# EAGLE schematic Aegis_PCB_MB_v46 (EAGLE 9.7.0)

## Sheet 1 of 12: Battery Charger
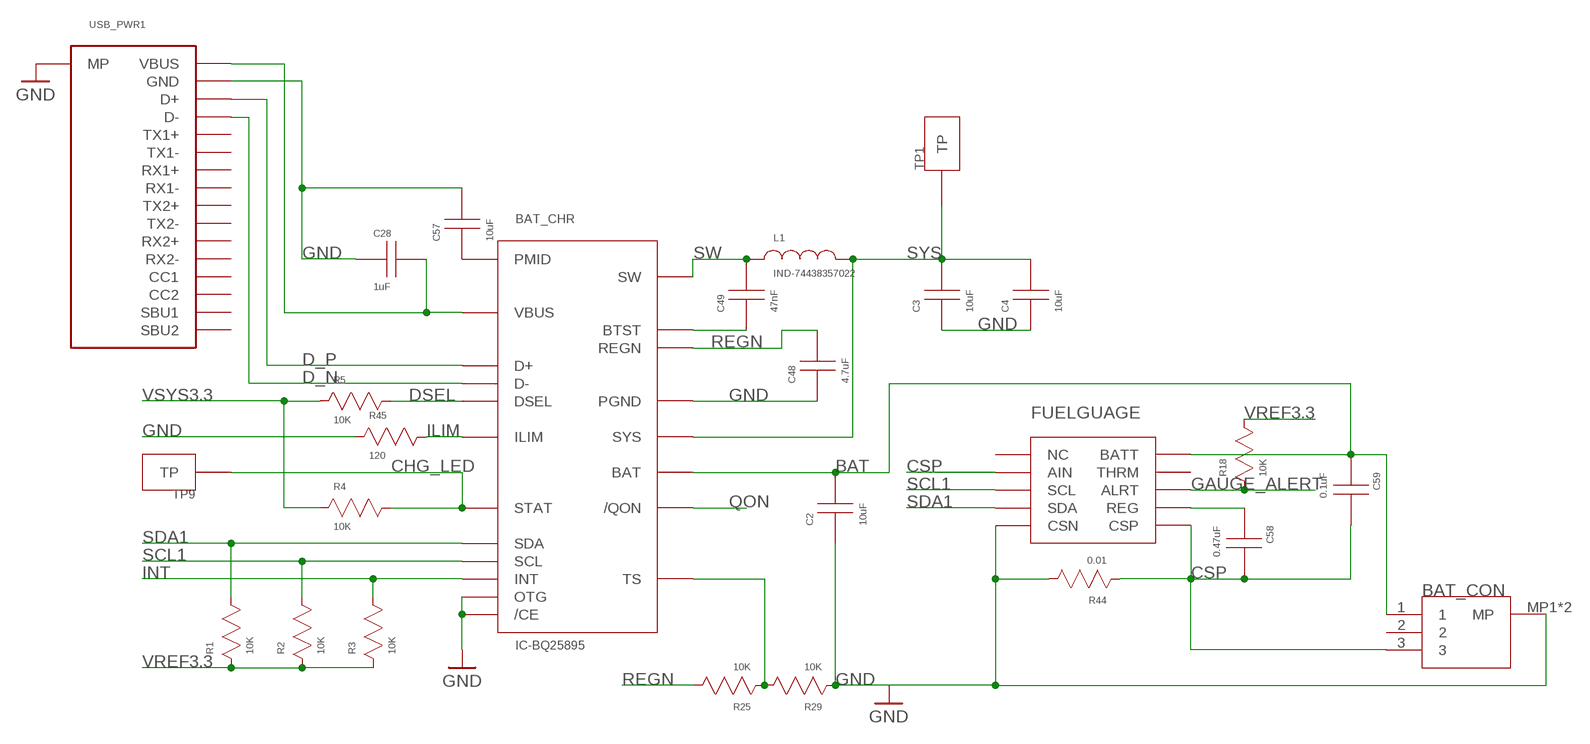
[diagram p0: schematic, sheet 1]

### Parts
BAT_CHR  IC-BQ25895  [IC-BQ25895]
BAT_CON  CONN-AUH03  [CONN_AUH03]
C2  10uF  CAP-603  [CAP-603]
C3  10uF  CAP-603  [CAP-603]
C4  10uF  CAP-603  [CAP-603]
C28  1uF  CAP-603  [CAP-603]
C48  4.7uF  CAP-603  [CAP-603]
C49  47nF  CAP-603  [CAP-603]
C57  10uF  CAP-603  [CAP-603]
C58  0.47uF  CAP-603  [CAP-603]
C59  0.1uF  CAP-603  [CAP-603]
FUELGUAGE  IC-MAX17055  [IC-MAX17055]
L1  IND-74438357022  [IND-74438357022]
R1  10K  RES-603  [RES-603]
R2  10K  RES-603  [RES-603]
R3  10K  RES-603  [RES-603]
R4  10K  RES-603  [RES-603]
R5  10K  RES-603  [RES-603]
R18  10K  RES-603  [RES-603]
R25  10K  RES-603  [RES-603]
R29  10K  RES-603  [RES-603]
R44  0.01  RES-603  [RES-603]
R45  120  RES-603  [RES-603]
TP1  TESTPOINT  [TESTPOINT]
TP9  TESTPOINT  [TESTPOINT]
USB_PWR1  USBC-USB-C31-S-RA-CS1D-BK-T/R  [USBC-USB-C31-S-RA-CS1D-BK-T/R]

### Nets
BAT: BAT_CHR.BAT1(BAT) BAT_CHR.BAT2(BAT) BAT_CON.1 C2.C C59.A FUELGUAGE.BATT
CHG_LED: BAT_CHR.STAT R4.C TP9.TP ; also sheet 10
CSP: BAT_CON.3 C58.C C59.C FUELGUAGE.AIN FUELGUAGE.CSP FUELGUAGE.EP(CSP) R44.A
D_N: BAT_CHR.D- USB_PWR1.D- USB_PWR1.D-_2(D-)
D_P: BAT_CHR.D+ USB_PWR1.D+ USB_PWR1.D+_2(D+)
DSEL: BAT_CHR.DSEL R5.C
GAUGE_ALERT: FUELGUAGE.ALRT R18.A
GND: BAT_CHR./CE BAT_CHR.OTG BAT_CHR.PGND1(PGND) BAT_CHR.PGND2(PGND) BAT_CHR.PWRPAD(PGND) BAT_CON.MP1(MP) BAT_CON.MP2(MP) C2.A C3.A C4.A C28.A C48.A C57.C FUELGUAGE.CSN R29.A R44.C R45.A USB_PWR1.GND_1(GND) USB_PWR1.GND_2(GND) USB_PWR1.GND_3(GND) USB_PWR1.GND_4(GND) USB_PWR1.MP_1(MP) USB_PWR1.MP_2(MP) USB_PWR1.MP_3(MP) USB_PWR1.MP_4(MP) ; also sheet 2,3,4,5,6,7,8,9,10,11,12
ILIM: BAT_CHR.ILIM R45.C
INT: BAT_CHR.INT R3.C
N$1: BAT_CHR.BTST C49.A
N$2: BAT_CHR.VBUS C28.C USB_PWR1.VBUS_1(VBUS) USB_PWR1.VBUS_2(VBUS) USB_PWR1.VBUS_3(VBUS) USB_PWR1.VBUS_4(VBUS)
N$4: BAT_CHR.TS R25.A R29.C
N$11: BAT_CHR.PMID C57.A
N$67: C58.A FUELGUAGE.REG
QON: BAT_CHR./QON
REGN: BAT_CHR.REGN C48.C R25.C
SCL1: BAT_CHR.SCL FUELGUAGE.SCL R2.C ; also sheet 8
SDA1: BAT_CHR.SDA FUELGUAGE.SDA R1.C ; also sheet 8
SW: BAT_CHR.SW1(SW) BAT_CHR.SW2(SW) C49.C L1.A
SYS: BAT_CHR.SYS1(SYS) BAT_CHR.SYS2(SYS) C3.C C4.C L1.C TP1.TP ; also sheet 2,3
VREF3.3: R1.A R2.A R3.A R18.C ; also sheet 4,9,10,11,12
VSYS3.3: R4.A R5.A ; also sheet 3,4,10
Unconnected: BAT_CON.2 FUELGUAGE.NC FUELGUAGE.THRM USB_PWR1.CC1 USB_PWR1.CC2 USB_PWR1.RX1+ USB_PWR1.RX1- USB_PWR1.RX2+ USB_PWR1.RX2- USB_PWR1.SBU1 USB_PWR1.SBU2 USB_PWR1.TX1+ USB_PWR1.TX1- USB_PWR1.TX2+ USB_PWR1.TX2-

## Sheet 2 of 12: 5V Regulator
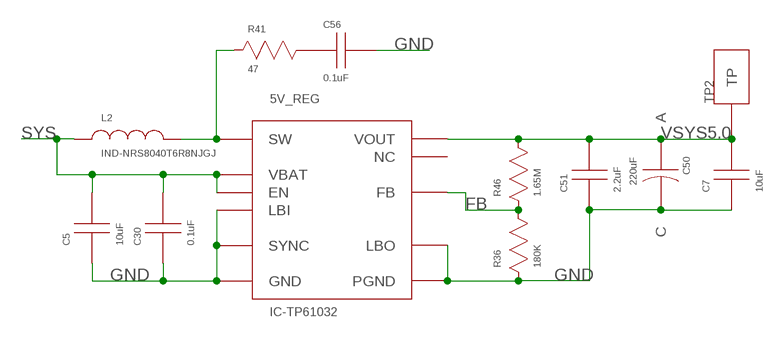
[diagram p1: schematic, sheet 2]

### Parts
5V_REG  IC-TP61032  [IC-TPS61032]
C5  10uF  CAP-603  [CAP-603]
C7  10uF  CAP-603  [CAP-603]
C30  0.1uF  CAP-603  [CAP-603]
C50  220uF  CAP-TAN-1411  [CAP-TAN-1411]
C51  2.2uF  CAP-603  [CAP-603]
C56  0.1uF  CAP-603  [CAP-603]
L2  IND-NRS8040T6R8NJGJ  [IND-NRS8040T6R8NJGJ]
R36  180K  RES-603  [RES-603]
R41  47  RES-603  [RES-603]
R46  1.65M  RES-603  [RES-603]
TP2  TESTPOINT  [TESTPOINT]

### Nets
FB: 5V_REG.FB R36.C R46.A
GND: 5V_REG.GND 5V_REG.LBI 5V_REG.LBO 5V_REG.PGND1(PGND) 5V_REG.PGND2(PGND) 5V_REG.PGND3(PGND) 5V_REG.PWRPAD(PGND) 5V_REG.SYNC C5.A C7.A C30.A C50.C C51.A C56.C R36.A ; also sheet 1,3,4,5,6,7,8,9,10,11,12
N$6: C56.A R41.C
SNUB: 5V_REG.SW1(SW) 5V_REG.SW2(SW) L2.C R41.A
SYS: 5V_REG.EN 5V_REG.VBAT C5.C C30.C L2.A ; also sheet 1,3
VSYS5.0: 5V_REG.VOUT1(VOUT) 5V_REG.VOUT2(VOUT) 5V_REG.VOUT3(VOUT) C7.C C50.A C51.C R46.C TP2.TP ; also sheet 4
Unconnected: 5V_REG.NC

## Sheet 3 of 12: 3.3V Regulator
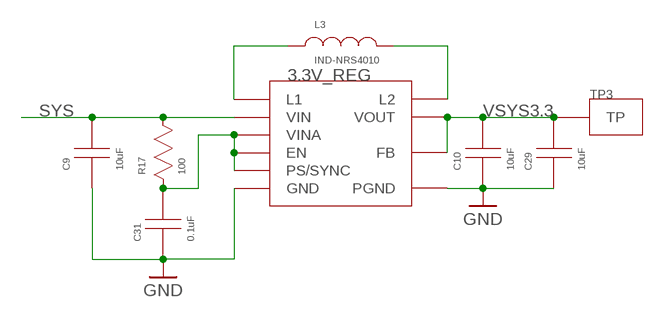
[diagram p2: schematic, sheet 3]

### Parts
3.3V_REG  IC-TPS63001DRCR  [IC-TPS63001DRCR]
C9  10uF  CAP-603  [CAP-603]
C10  10uF  CAP-603  [CAP-603]
C29  10uF  CAP-603  [CAP-603]
C31  0.1uF  CAP-603  [CAP-603]
L3  IND-NRS4010  [IND-NRS4010]
R17  100  RES-603  [RES-603]
TP3  TESTPOINT  [TESTPOINT]

### Nets
GND: 3.3V_REG.GND 3.3V_REG.PGND 3.3V_REG.PGND_1(PGND) 3.3V_REG.PGND_2(PGND) 3.3V_REG.PGND_3(PGND) 3.3V_REG.PGND_4(PGND) 3.3V_REG.PGND_5(PGND) C9.A C10.A C29.A C31.A ; also sheet 1,2,4,5,6,7,8,9,10,11,12
N$8: 3.3V_REG.EN 3.3V_REG.PS/SYNC 3.3V_REG.VINA C31.C R17.A
N$63: 3.3V_REG.L1 L3.A
N$66: 3.3V_REG.L2 L3.C
SYS: 3.3V_REG.VIN C9.C R17.C ; also sheet 1,2
VSYS3.3: 3.3V_REG.FB 3.3V_REG.VOUT C10.C C29.C TP3.TP ; also sheet 1,4,10

## Sheet 4 of 12: Power Switch
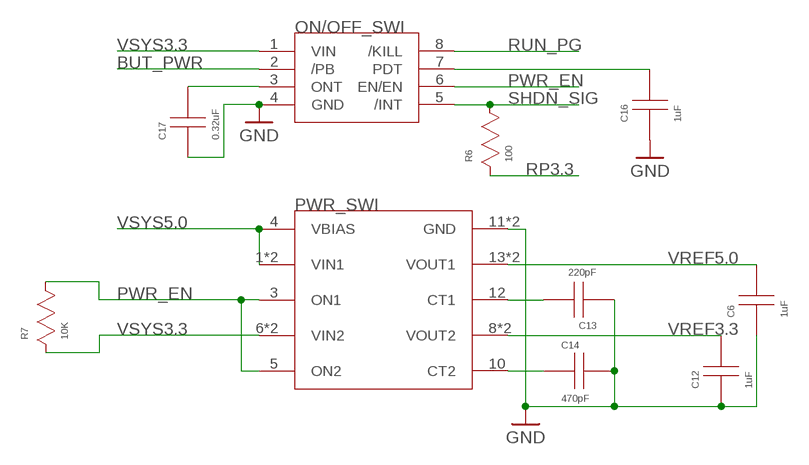
[diagram p3: schematic, sheet 4]

### Parts
C6  1uF  CAP-603  [CAP-603]
C12  1uF  CAP-603  [CAP-603]
C13  220pF  CAP-603  [CAP-603]
C14  470pF  CAP-603  [CAP-603]
C16  1uF  CAP-603  [CAP-603]
C17  0.32uF  CAP-603  [CAP-603]
ON/OFF_SWI  IC-LTC2954  [IC-LTC2954]
PWR_SWI  IC-TPS22976  [IC-TPS22976]
R6  100  RES-603  [RES-603]
R7  10K  RES-603  [RES-603]

### Nets
BUT_PWR: ON/OFF_SWI.2(/PB) ; also sheet 10
GND: C6.A C12.A C13.A C14.C C16.A C17.A ON/OFF_SWI.4(GND) PWR_SWI.11(GND) PWR_SWI.15(GND) ; also sheet 1,2,3,5,6,7,8,9,10,11,12
N$3: C13.C PWR_SWI.12(CT1)
N$5: C14.A PWR_SWI.10(CT2)
N$7: C16.C ON/OFF_SWI.7(PDT)
N$9: C17.C ON/OFF_SWI.3(ONT)
PWR_EN: ON/OFF_SWI.6(EN/EN) PWR_SWI.3(ON1) PWR_SWI.5(ON2) R7.C
RP3.3: R6.A ; also sheet 6,8,9
RUN_PG: ON/OFF_SWI.8(/KILL) ; also sheet 8
SHDN_SIG: ON/OFF_SWI.5(/INT) R6.C ; also sheet 8
VREF3.3: C12.C PWR_SWI.8(VOUT2) PWR_SWI.9(VOUT2) ; also sheet 1,9,10,11,12
VREF5.0: C6.C PWR_SWI.13(VOUT1) PWR_SWI.14(VOUT1) ; also sheet 7,8,11
VSYS3.3: ON/OFF_SWI.1(VIN) PWR_SWI.6(VIN2) PWR_SWI.7(VIN2) R7.A ; also sheet 1,3,10
VSYS5.0: PWR_SWI.1(VIN1) PWR_SWI.2(VIN1) PWR_SWI.4(VBIAS) ; also sheet 2

## Sheet 5 of 12: Audio
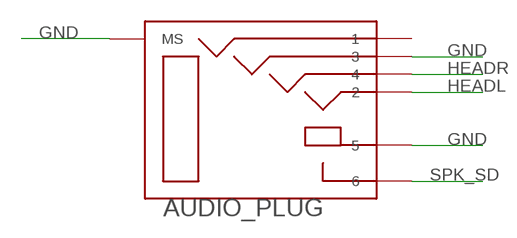
[diagram p4: schematic, sheet 5]

### Parts
AUDIO_PLUG  AUDIOPLUG-ASJ-192-Y-TR  [AUDIOPLUG-ASJ-192-Y-TR]

### Nets
GND: AUDIO_PLUG.3 AUDIO_PLUG.5 AUDIO_PLUG.MS1(MS) AUDIO_PLUG.MS2(MS) ; also sheet 1,2,3,4,6,7,8,9,10,11,12
HEADL: AUDIO_PLUG.2 ; also sheet 10
HEADR: AUDIO_PLUG.4 ; also sheet 10
SPK_SD: AUDIO_PLUG.6 ; also sheet 10
Unconnected: AUDIO_PLUG.1

## Sheet 6 of 12: MicroSD
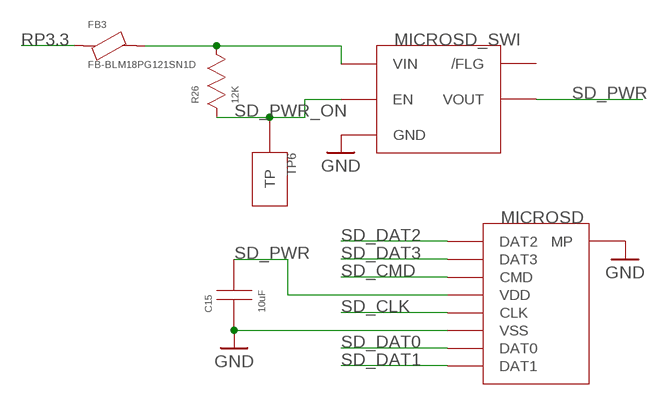
[diagram p5: schematic, sheet 6]

### Parts
C15  10uF  CAP-603  [CAP-603]
FB3  FB-BLM18PG121SN1D  [FB-BLM18PG121SN1D]
MICROSD  MICROSD-5033981892_SD  [MICROSD-5033981892_SD]
MICROSD_SWI  IC-RT9742  [IC-RT9742]
R26  12K  RES-603  [RES-603]
TP6  TESTPOINT  [TESTPOINT]

### Nets
GND: C15.A MICROSD.DL(MP) MICROSD.DS(MP) MICROSD.MP_1(MP) MICROSD.MP_2(MP) MICROSD.MP_3(MP) MICROSD.MP_4(MP) MICROSD.VSS MICROSD_SWI.GND ; also sheet 1,2,3,4,5,7,8,9,10,11,12
N$20: FB3.C MICROSD_SWI.VIN R26.C
RP3.3: FB3.A ; also sheet 4,8,9
SD_CLK: MICROSD.CLK ; also sheet 8
SD_CMD: MICROSD.CMD ; also sheet 8
SD_DAT0: MICROSD.DAT0 ; also sheet 8
SD_DAT1: MICROSD.DAT1 ; also sheet 8
SD_DAT2: MICROSD.DAT2 ; also sheet 8
SD_DAT3: MICROSD.DAT3 ; also sheet 8
SD_PWR: C15.C MICROSD.VDD MICROSD_SWI.VOUT
SD_PWR_ON: MICROSD_SWI.EN R26.A TP6.TP ; also sheet 8
Unconnected: MICROSD_SWI./FLG

## Sheet 7 of 12: HDMI
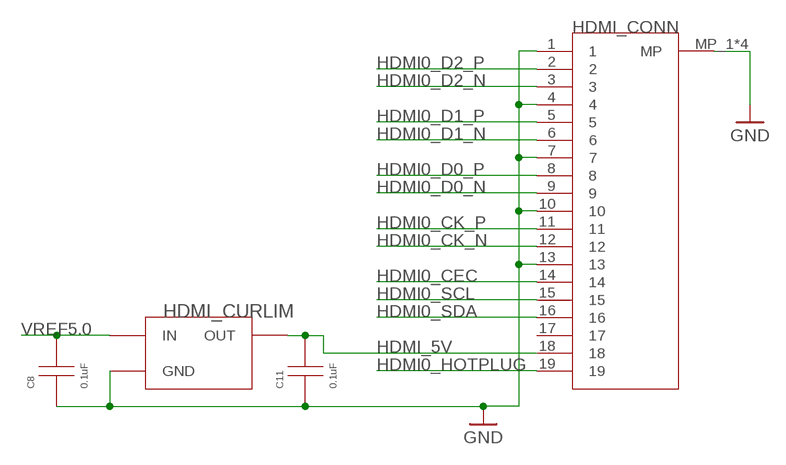
[diagram p6: schematic, sheet 7]

### Parts
C8  0.1uF  CAP-603  [CAP-603]
C11  0.1uF  CAP-603  [CAP-603]
HDMI_CONN  HDMI-2001-1-2-21-00-BK  [HDMI-2001-1-2-21-00-BK]
HDMI_CURLIM  CURLIM-AP2331  [CURLIM-AP2331]

### Nets
GND: C8.A C11.A HDMI_CONN.1 HDMI_CONN.4 HDMI_CONN.7 HDMI_CONN.10 HDMI_CONN.13 HDMI_CONN.MP_1(MP) HDMI_CONN.MP_2(MP) HDMI_CONN.MP_3(MP) HDMI_CONN.MP_4(MP) HDMI_CURLIM.GND ; also sheet 1,2,3,4,5,6,8,9,10,11,12
HDMI0_CEC: HDMI_CONN.14 ; also sheet 8
HDMI0_CK_N: HDMI_CONN.12 ; also sheet 8
HDMI0_CK_P: HDMI_CONN.11 ; also sheet 8
HDMI0_D0_N: HDMI_CONN.9 ; also sheet 8
HDMI0_D0_P: HDMI_CONN.8 ; also sheet 8
HDMI0_D1_N: HDMI_CONN.6 ; also sheet 8
HDMI0_D1_P: HDMI_CONN.5 ; also sheet 8
HDMI0_D2_N: HDMI_CONN.3 ; also sheet 8
HDMI0_D2_P: HDMI_CONN.2 ; also sheet 8
HDMI0_HOTPLUG: HDMI_CONN.19 ; also sheet 8
HDMI0_SCL: HDMI_CONN.15 ; also sheet 8
HDMI0_SDA: HDMI_CONN.16 ; also sheet 8
HDMI_5V: C11.C HDMI_CONN.18 HDMI_CURLIM.OUT
VREF5.0: C8.C HDMI_CURLIM.IN ; also sheet 4,8,11
Unconnected: HDMI_CONN.17

## Sheet 8 of 12: Raspberry PI CM4
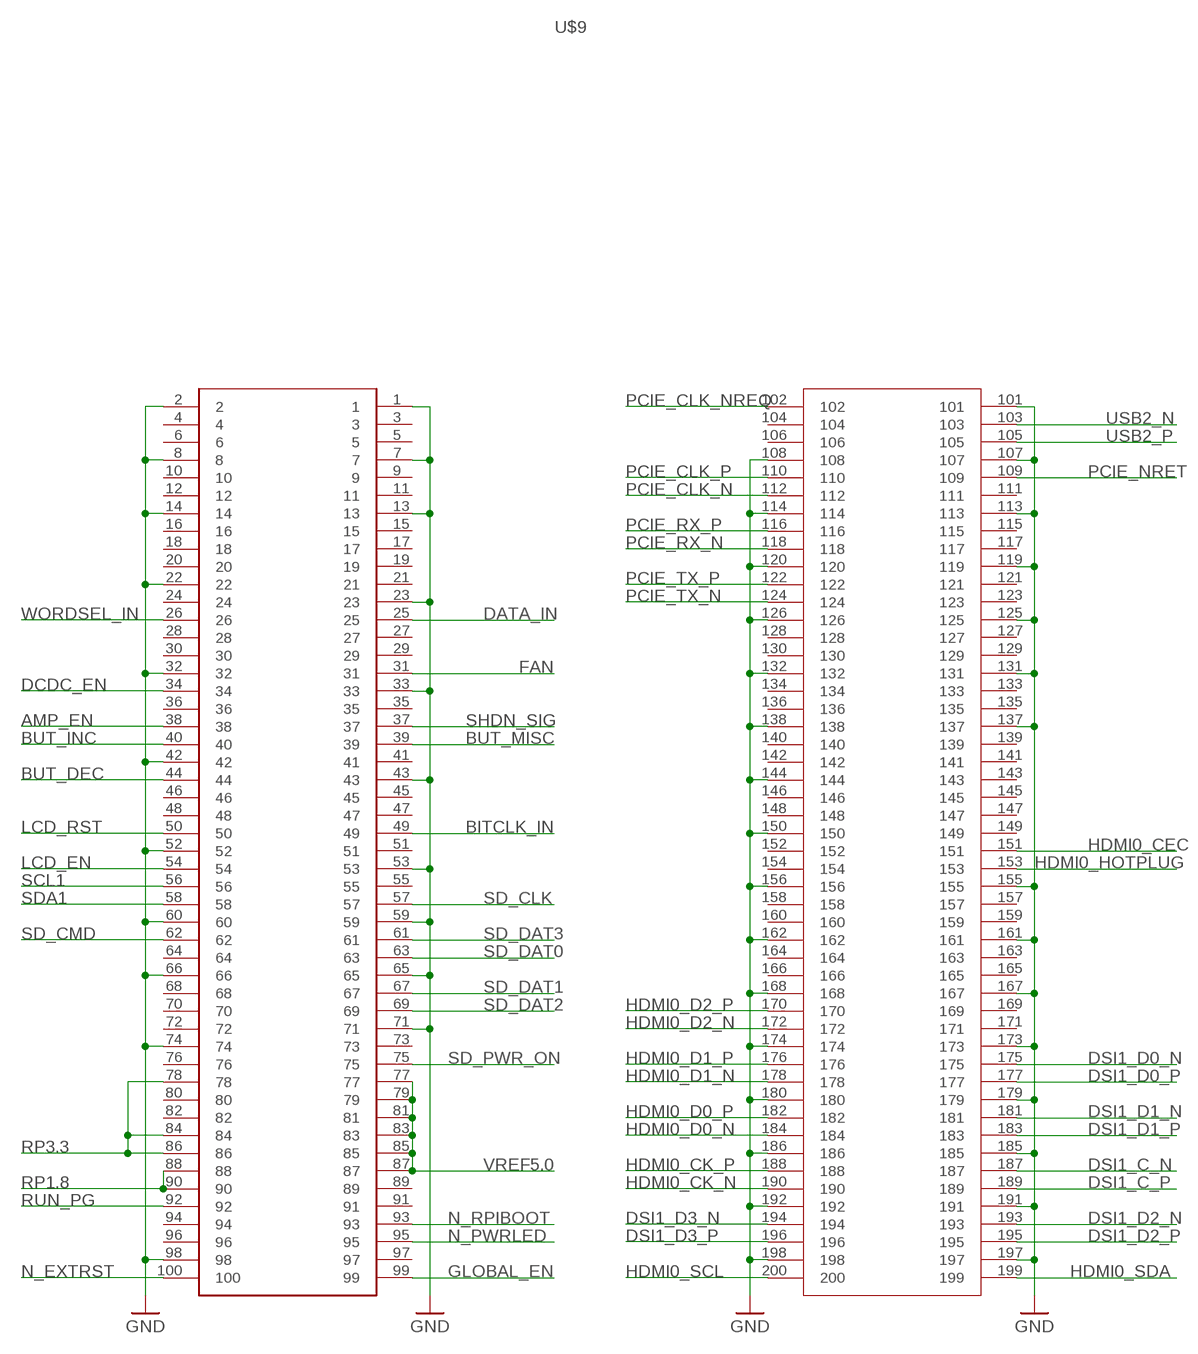
[diagram p7: schematic, sheet 8]

### Parts
U$9  RP_CM4  [RP_CM4]

### Nets
AMP_EN: U$9.38 ; also sheet 10
BITCLK_IN: U$9.49 ; also sheet 10
BUT_DEC: U$9.44 ; also sheet 10
BUT_INC: U$9.40 ; also sheet 10
BUT_MISC: U$9.39 ; also sheet 10
DATA_IN: U$9.25 ; also sheet 10
DCDC_EN: U$9.34 ; also sheet 9
DSI1_C_N: U$9.187 ; also sheet 9
DSI1_C_P: U$9.189 ; also sheet 9
DSI1_D0_N: U$9.175 ; also sheet 9
DSI1_D0_P: U$9.177 ; also sheet 9
DSI1_D1_N: U$9.181 ; also sheet 9
DSI1_D1_P: U$9.183 ; also sheet 9
DSI1_D2_N: U$9.193 ; also sheet 9
DSI1_D2_P: U$9.195 ; also sheet 9
DSI1_D3_N: U$9.194 ; also sheet 9
DSI1_D3_P: U$9.196 ; also sheet 9
FAN: U$9.31 ; also sheet 12
GLOBAL_EN: U$9.99
GND: U$9.1 U$9.2 U$9.7 U$9.8 U$9.13 U$9.14 U$9.22 U$9.23 U$9.32 U$9.33 U$9.42 U$9.43 U$9.52 U$9.53 U$9.59 U$9.60 U$9.65 U$9.66 U$9.71 U$9.74 U$9.98 U$9.101 U$9.107 U$9.108 U$9.113 U$9.114 U$9.119 U$9.120 U$9.125 U$9.126 U$9.131 U$9.132 U$9.137 U$9.138 U$9.144 U$9.150 U$9.155 U$9.156 U$9.161 U$9.162 U$9.167 U$9.168 U$9.173 U$9.174 U$9.179 U$9.180 U$9.185 U$9.186 U$9.191 U$9.192 U$9.197 U$9.198 ; also sheet 1,2,3,4,5,6,7,9,10,11,12
HDMI0_CEC: U$9.151 ; also sheet 7
HDMI0_CK_N: U$9.190 ; also sheet 7
HDMI0_CK_P: U$9.188 ; also sheet 7
HDMI0_D0_N: U$9.184 ; also sheet 7
HDMI0_D0_P: U$9.182 ; also sheet 7
HDMI0_D1_N: U$9.178 ; also sheet 7
HDMI0_D1_P: U$9.176 ; also sheet 7
HDMI0_D2_N: U$9.172 ; also sheet 7
HDMI0_D2_P: U$9.170 ; also sheet 7
HDMI0_HOTPLUG: U$9.153 ; also sheet 7
HDMI0_SCL: U$9.200 ; also sheet 7
HDMI0_SDA: U$9.199 ; also sheet 7
LCD_EN: U$9.54 ; also sheet 9
LCD_RST: U$9.50 ; also sheet 9
N_EXTRST: U$9.100 ; also sheet 11
N_PWRLED: U$9.95 ; also sheet 10
N_RPIBOOT: U$9.93
PCIE_CLK_N: U$9.112
PCIE_CLK_NREQ: U$9.102
PCIE_CLK_P: U$9.110
PCIE_NRET: U$9.109
PCIE_RX_N: U$9.118
PCIE_RX_P: U$9.116
PCIE_TX_N: U$9.124
PCIE_TX_P: U$9.122
RP1.8: U$9.88 U$9.90 ; also sheet 9
RP3.3: U$9.78 U$9.84 U$9.86 ; also sheet 4,6,9
RUN_PG: U$9.92 ; also sheet 4
SCL1: U$9.56 ; also sheet 1
SD_CLK: U$9.57 ; also sheet 6
SD_CMD: U$9.62 ; also sheet 6
SD_DAT0: U$9.63 ; also sheet 6
SD_DAT1: U$9.67 ; also sheet 6
SD_DAT2: U$9.69 ; also sheet 6
SD_DAT3: U$9.61 ; also sheet 6
SD_PWR_ON: U$9.75 ; also sheet 6
SDA1: U$9.58 ; also sheet 1
SHDN_SIG: U$9.37 ; also sheet 4
USB2_N: U$9.103 ; also sheet 11
USB2_P: U$9.105 ; also sheet 11
VREF5.0: U$9.77 U$9.79 U$9.81 U$9.83 U$9.85 U$9.87 ; also sheet 4,7,11
WORDSEL_IN: U$9.26 ; also sheet 10
Unconnected: U$9.3 U$9.4 U$9.5 U$9.6 U$9.9 U$9.10 U$9.11 U$9.12 U$9.15 U$9.16 U$9.17 U$9.18 U$9.19 U$9.20 U$9.21 U$9.24 U$9.27 U$9.28 U$9.29 U$9.30 U$9.35 U$9.36 U$9.41 U$9.45 U$9.46 U$9.47 U$9.48 U$9.51 U$9.55 U$9.64 U$9.68 U$9.70 U$9.72 U$9.73 U$9.76 U$9.80 U$9.82 U$9.89 U$9.91 U$9.94 U$9.96 U$9.97 U$9.104 U$9.106 U$9.111 U$9.115 U$9.117 U$9.121 U$9.123 U$9.127 U$9.128 U$9.129 U$9.130 U$9.133 U$9.134 U$9.135 U$9.136 U$9.139 U$9.140 U$9.141 U$9.142 U$9.143 U$9.145 U$9.146 U$9.147 U$9.148 U$9.149 U$9.152 U$9.154 U$9.157 U$9.158 U$9.159 U$9.160 U$9.163 U$9.164 U$9.165 U$9.166 U$9.169 U$9.171

## Sheet 9 of 12: Screen
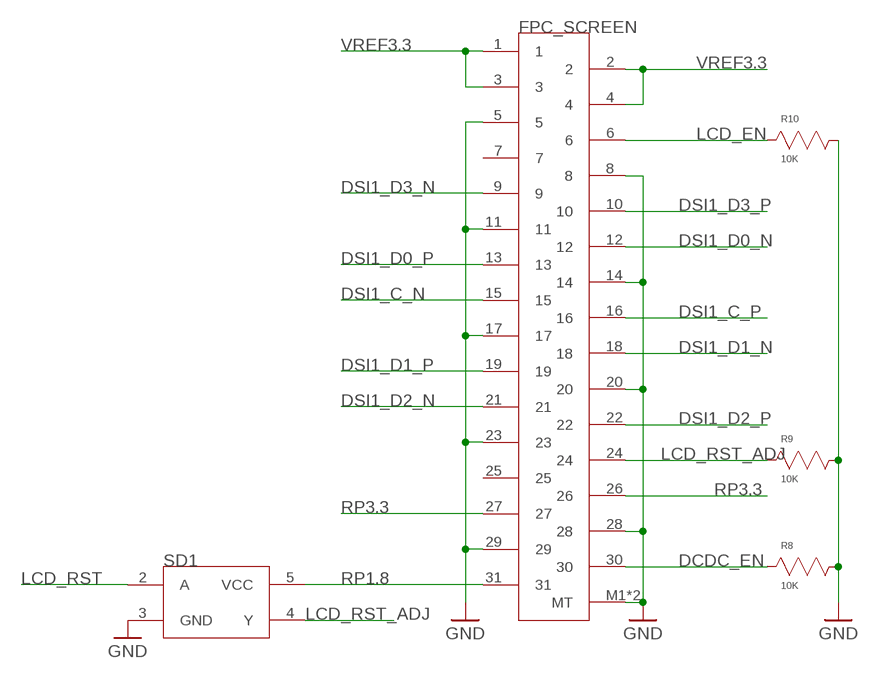
[diagram p8: schematic, sheet 9]

### Parts
FPC_SCREEN  CONN-FH35C-31S-0.3SHW  [CONN-FH35C-31S-0.3SHW]
R8  10K  RES-603  [RES-603]
R9  10K  RES-603  [RES-603]
R10  10K  RES-603  [RES-603]
SD1  SCHDIODE-SN74LVC1G17  [SCHDIODE-SN74LVC1G17]

### Nets
DCDC_EN: FPC_SCREEN.30 R8.A ; also sheet 8
DSI1_C_N: FPC_SCREEN.15 ; also sheet 8
DSI1_C_P: FPC_SCREEN.16 ; also sheet 8
DSI1_D0_N: FPC_SCREEN.12 ; also sheet 8
DSI1_D0_P: FPC_SCREEN.13 ; also sheet 8
DSI1_D1_N: FPC_SCREEN.18 ; also sheet 8
DSI1_D1_P: FPC_SCREEN.19 ; also sheet 8
DSI1_D2_N: FPC_SCREEN.21 ; also sheet 8
DSI1_D2_P: FPC_SCREEN.22 ; also sheet 8
DSI1_D3_N: FPC_SCREEN.9 ; also sheet 8
DSI1_D3_P: FPC_SCREEN.10 ; also sheet 8
GND: FPC_SCREEN.5 FPC_SCREEN.8 FPC_SCREEN.11 FPC_SCREEN.14 FPC_SCREEN.17 FPC_SCREEN.20 FPC_SCREEN.23 FPC_SCREEN.28 FPC_SCREEN.29 FPC_SCREEN.M1(MT) FPC_SCREEN.M2(MT) R8.C R9.C R10.C SD1.3(GND) ; also sheet 1,2,3,4,5,6,7,8,10,11,12
LCD_EN: FPC_SCREEN.6 R10.A ; also sheet 8
LCD_RST: SD1.2(A) ; also sheet 8
LCD_RST_ADJ: FPC_SCREEN.24 R9.A SD1.4(Y)
RP1.8: FPC_SCREEN.31 SD1.5(VCC) ; also sheet 8
RP3.3: FPC_SCREEN.26 FPC_SCREEN.27 ; also sheet 4,6,8
VREF3.3: FPC_SCREEN.1 FPC_SCREEN.2 FPC_SCREEN.3 FPC_SCREEN.4 ; also sheet 1,4,10,11,12
Unconnected: FPC_SCREEN.7 FPC_SCREEN.25

## Sheet 10 of 12: Board Connector
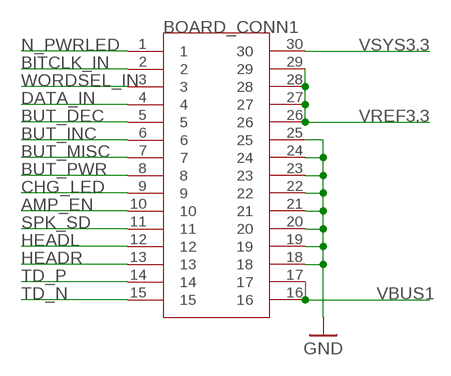
[diagram p9: schematic, sheet 10]

### Parts
BOARD_CONN1  CONN-AXK5F30347YG  [CONN-AXK5F30347YG]

### Nets
AMP_EN: BOARD_CONN1.10 ; also sheet 8
BITCLK_IN: BOARD_CONN1.2 ; also sheet 8
BUT_DEC: BOARD_CONN1.5 ; also sheet 8
BUT_INC: BOARD_CONN1.6 ; also sheet 8
BUT_MISC: BOARD_CONN1.7 ; also sheet 8
BUT_PWR: BOARD_CONN1.8 ; also sheet 4
CHG_LED: BOARD_CONN1.9 ; also sheet 1
DATA_IN: BOARD_CONN1.4 ; also sheet 8
GND: BOARD_CONN1.18 BOARD_CONN1.19 BOARD_CONN1.20 BOARD_CONN1.21 BOARD_CONN1.22 BOARD_CONN1.23 BOARD_CONN1.24 BOARD_CONN1.25 ; also sheet 1,2,3,4,5,6,7,8,9,11,12
HEADL: BOARD_CONN1.12 ; also sheet 5
HEADR: BOARD_CONN1.13 ; also sheet 5
N_PWRLED: BOARD_CONN1.1 ; also sheet 8
SPK_SD: BOARD_CONN1.11 ; also sheet 5
TD_N: BOARD_CONN1.15 ; also sheet 11
TD_P: BOARD_CONN1.14 ; also sheet 11
VBUS1: BOARD_CONN1.16 BOARD_CONN1.17 ; also sheet 11
VREF3.3: BOARD_CONN1.26 BOARD_CONN1.27 BOARD_CONN1.28 BOARD_CONN1.29 ; also sheet 1,4,9,11,12
VSYS3.3: BOARD_CONN1.30 ; also sheet 1,3,4
WORDSEL_IN: BOARD_CONN1.3 ; also sheet 8

## Sheet 11 of 12: USB
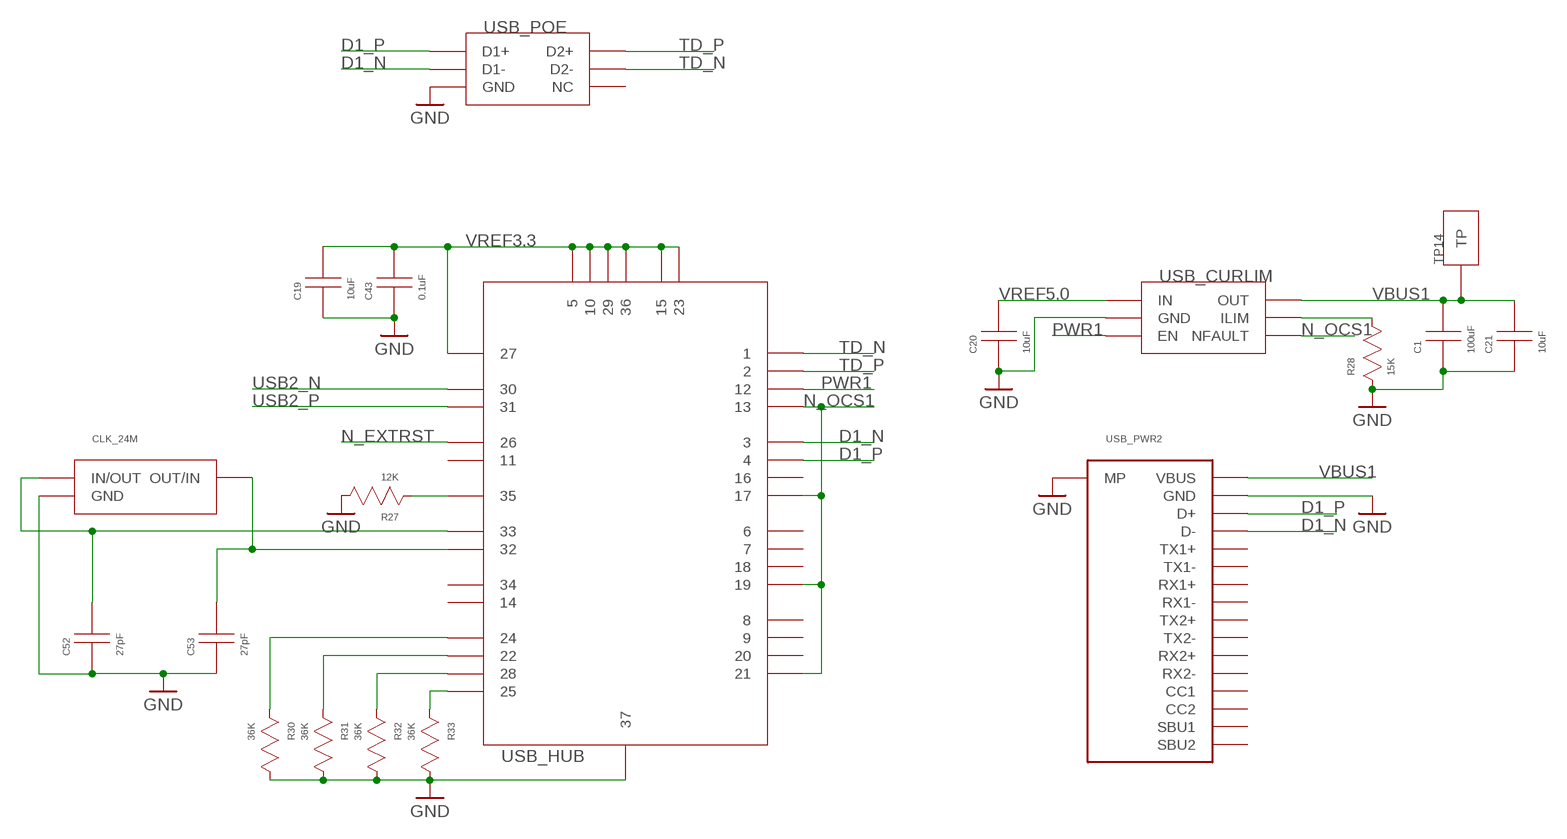
[diagram p10: schematic, sheet 11]

### Parts
C1  100uF  CAP-603  [CAP-603]
C19  10uF  CAP-603  [CAP-603]
C20  10uF  CAP-603  [CAP-603]
C21  10uF  CAP-603  [CAP-603]
C43  0.1uF  CAP-603  [CAP-603]
C52  27pF  CAP-603  [CAP-603]
C53  27pF  CAP-603  [CAP-603]
CLK_24M  CLK-ECS-240  [CLK-ECS-240]
R27  12K  RES-603  [RES-603]
R28  15K  RES-603  [RES-603]
R30  36K  RES-603  [RES-603]
R31  36K  RES-603  [RES-603]
R32  36K  RES-603  [RES-603]
R33  36K  RES-603  [RES-603]
TP14  TESTPOINT  [TESTPOINT]
USB_CURLIM  CURLIM-AP22653W6  [CURLIM-AP22653W6]
USB_HUB  USBPORT-USB2514BT-I/M2  [USBPORT-USB2514BT-I/M2]
USB_POE  POE_PROT-TPD4EUSB30DQAR  [POE_PROT-TPD4EUSB30DQAR]
USB_PWR2  USBC-USB-C31-S-RA-CS1D-BK-T/R  [USBC-USB-C31-S-RA-CS1D-BK-T/R]

### Nets
D1_N: USB_HUB.3 USB_POE.D1- USB_PWR2.D- USB_PWR2.D-_2(D-)
D1_P: USB_HUB.4 USB_POE.D1+ USB_PWR2.D+ USB_PWR2.D+_2(D+)
GND: C1.A C19.A C20.A C21.A C43.A C52.A C53.A CLK_24M.GND_1(GND) CLK_24M.GND_2(GND) R27.C R28.A R30.C R31.C R32.C R33.C USB_CURLIM.GND USB_HUB.37 USB_POE.GND_1(GND) USB_POE.GND_2(GND) USB_PWR2.GND_1(GND) USB_PWR2.GND_2(GND) USB_PWR2.GND_3(GND) USB_PWR2.GND_4(GND) USB_PWR2.MP_1(MP) USB_PWR2.MP_2(MP) USB_PWR2.MP_3(MP) USB_PWR2.MP_4(MP) ; also sheet 1,2,3,4,5,6,7,8,9,10,12
N$56: R32.A USB_HUB.28
N$57: R28.C USB_CURLIM.ILIM
N$58: R31.A USB_HUB.22
N$59: R30.A USB_HUB.24
N$61: C53.C CLK_24M.OUT/IN USB_HUB.32
N$62: C52.C CLK_24M.IN/OUT USB_HUB.33
N$64: R33.A USB_HUB.25
N$65: R27.A USB_HUB.35
N_EXTRST: USB_HUB.26 ; also sheet 8
N_OCS1: USB_CURLIM.NFAULT USB_HUB.13 USB_HUB.17 USB_HUB.19 USB_HUB.21
PWR1: USB_CURLIM.EN USB_HUB.12
TD_N: USB_HUB.1 USB_POE.D2- ; also sheet 10
TD_P: USB_HUB.2 USB_POE.D2+ ; also sheet 10
USB2_N: USB_HUB.30 ; also sheet 8
USB2_P: USB_HUB.31 ; also sheet 8
VBUS1: C1.C C21.C TP14.TP USB_CURLIM.OUT USB_PWR2.VBUS_1(VBUS) USB_PWR2.VBUS_2(VBUS) USB_PWR2.VBUS_3(VBUS) USB_PWR2.VBUS_4(VBUS) ; also sheet 10
VREF3.3: C19.C C43.C USB_HUB.5 USB_HUB.10 USB_HUB.15 USB_HUB.23 USB_HUB.27 USB_HUB.29 USB_HUB.36 ; also sheet 1,4,9,10,12
VREF5.0: C20.C USB_CURLIM.IN ; also sheet 4,7,8
Unconnected: USB_HUB.6 USB_HUB.7 USB_HUB.8 USB_HUB.9 USB_HUB.11 USB_HUB.14 USB_HUB.16 USB_HUB.18 USB_HUB.20 USB_HUB.34 USB_POE.NC_1(NC) USB_POE.NC_2(NC) USB_POE.NC_3(NC) USB_POE.NC_4(NC) USB_PWR2.CC1 USB_PWR2.CC2 USB_PWR2.RX1+ USB_PWR2.RX1- USB_PWR2.RX2+ USB_PWR2.RX2- USB_PWR2.SBU1 USB_PWR2.SBU2 USB_PWR2.TX1+ USB_PWR2.TX1- USB_PWR2.TX2+ USB_PWR2.TX2-

## Sheet 12 of 12
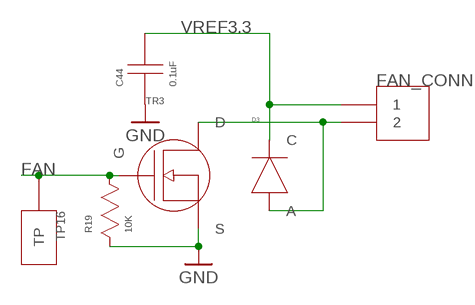
[diagram p11: schematic, sheet 12]

### Parts
C44  0.1uF  CAP-603  [CAP-603]
D3  DIODE-X3-WLB1608-2  [DIODE-X3-WLB1608-2]
FAN_CONN  CONN-282834-2  [CONN-282834-2]
R19  10K  RES-603  [RES-603]
TP16  TESTPOINT  [TESTPOINT]
TR3  TRAN-DMG2302UKQ  [TRAN-DMG2302UKQ]

### Nets
FAN: R19.C TP16.TP TR3.G ; also sheet 8
GND: C44.A R19.A TR3.S ; also sheet 1,2,3,4,5,6,7,8,9,10,11
N$55: D3.A FAN_CONN.2 TR3.D
VREF3.3: C44.C D3.C FAN_CONN.1 ; also sheet 1,4,9,10,11

## Library data of the parts
3.3V_REG = Personal:IC-TPS63001DRCR
5V_REG = Personal:IC-TP61032
AUDIO_PLUG = Personal:AUDIOPLUG-ASJ-192-Y-TR
BAT_CHR = Personal:IC-BQ25895
BAT_CON = Personal:CONN-AUH03
BOARD_CONN1 = Personal:CONN-AXK5F30347YG
C1-C17 C19-C21 C28-C31 C43 C44 C48 C49 C51-C53 C56-C59 = Personal:CAP-603
C50 = Personal:CAP-TAN-1411
CLK_24M = Personal:CLK-ECS-240
D3 = Personal:DIODE-X3-WLB1608-2
FAN_CONN = Personal:CONN-282834-2
FB3 = Personal:FB-BLM18PG121SN1D
FPC_SCREEN = Personal:CONN-FH35C-31S-0.3SHW
FUELGUAGE = Personal:IC-MAX17055
HDMI_CONN = Personal:HDMI-2001-1-2-21-00-BK
HDMI_CURLIM = Personal:CURLIM-AP2331
L1 = Personal:IND-74438357022
L2 = Personal:IND-NRS8040T6R8NJGJ
L3 = Personal:IND-NRS4010
MICROSD = Personal:MICROSD-5033981892_SD
MICROSD_SWI = Personal:IC-RT9742
ON/OFF_SWI = Personal:IC-LTC2954
PWR_SWI = Personal:IC-TPS22976
R1-R10 R17-R19 R25-R33 R36 R41 R44-R46 = Personal:RES-603
SD1 = Personal:SCHDIODE-SN74LVC1G17
TP1-TP3 TP6 TP9 TP14 TP16 = Personal:TESTPOINT
TR3 = Personal:TRAN-DMG2302UKQ
U$9 = Personal:RP_CM4
USB_CURLIM = Personal:CURLIM-AP22653W6
USB_HUB = Personal:USBPORT-USB2514BT-I/M2
USB_POE = Personal:POE_PROT-TPD4EUSB30DQAR
USB_PWR1 USB_PWR2 = Personal:USBC-USB-C31-S-RA-CS1D-BK-T/R

## Net classes
1 PWR 1A: width 0.254 mm